# EAGLE design microwave (EAGLE 6.6.0)
AUTHOR: Yifan Hao, Joshua Adkins; REV: B; TITLE: Microwave_Radar

## Sheet 1 of 3
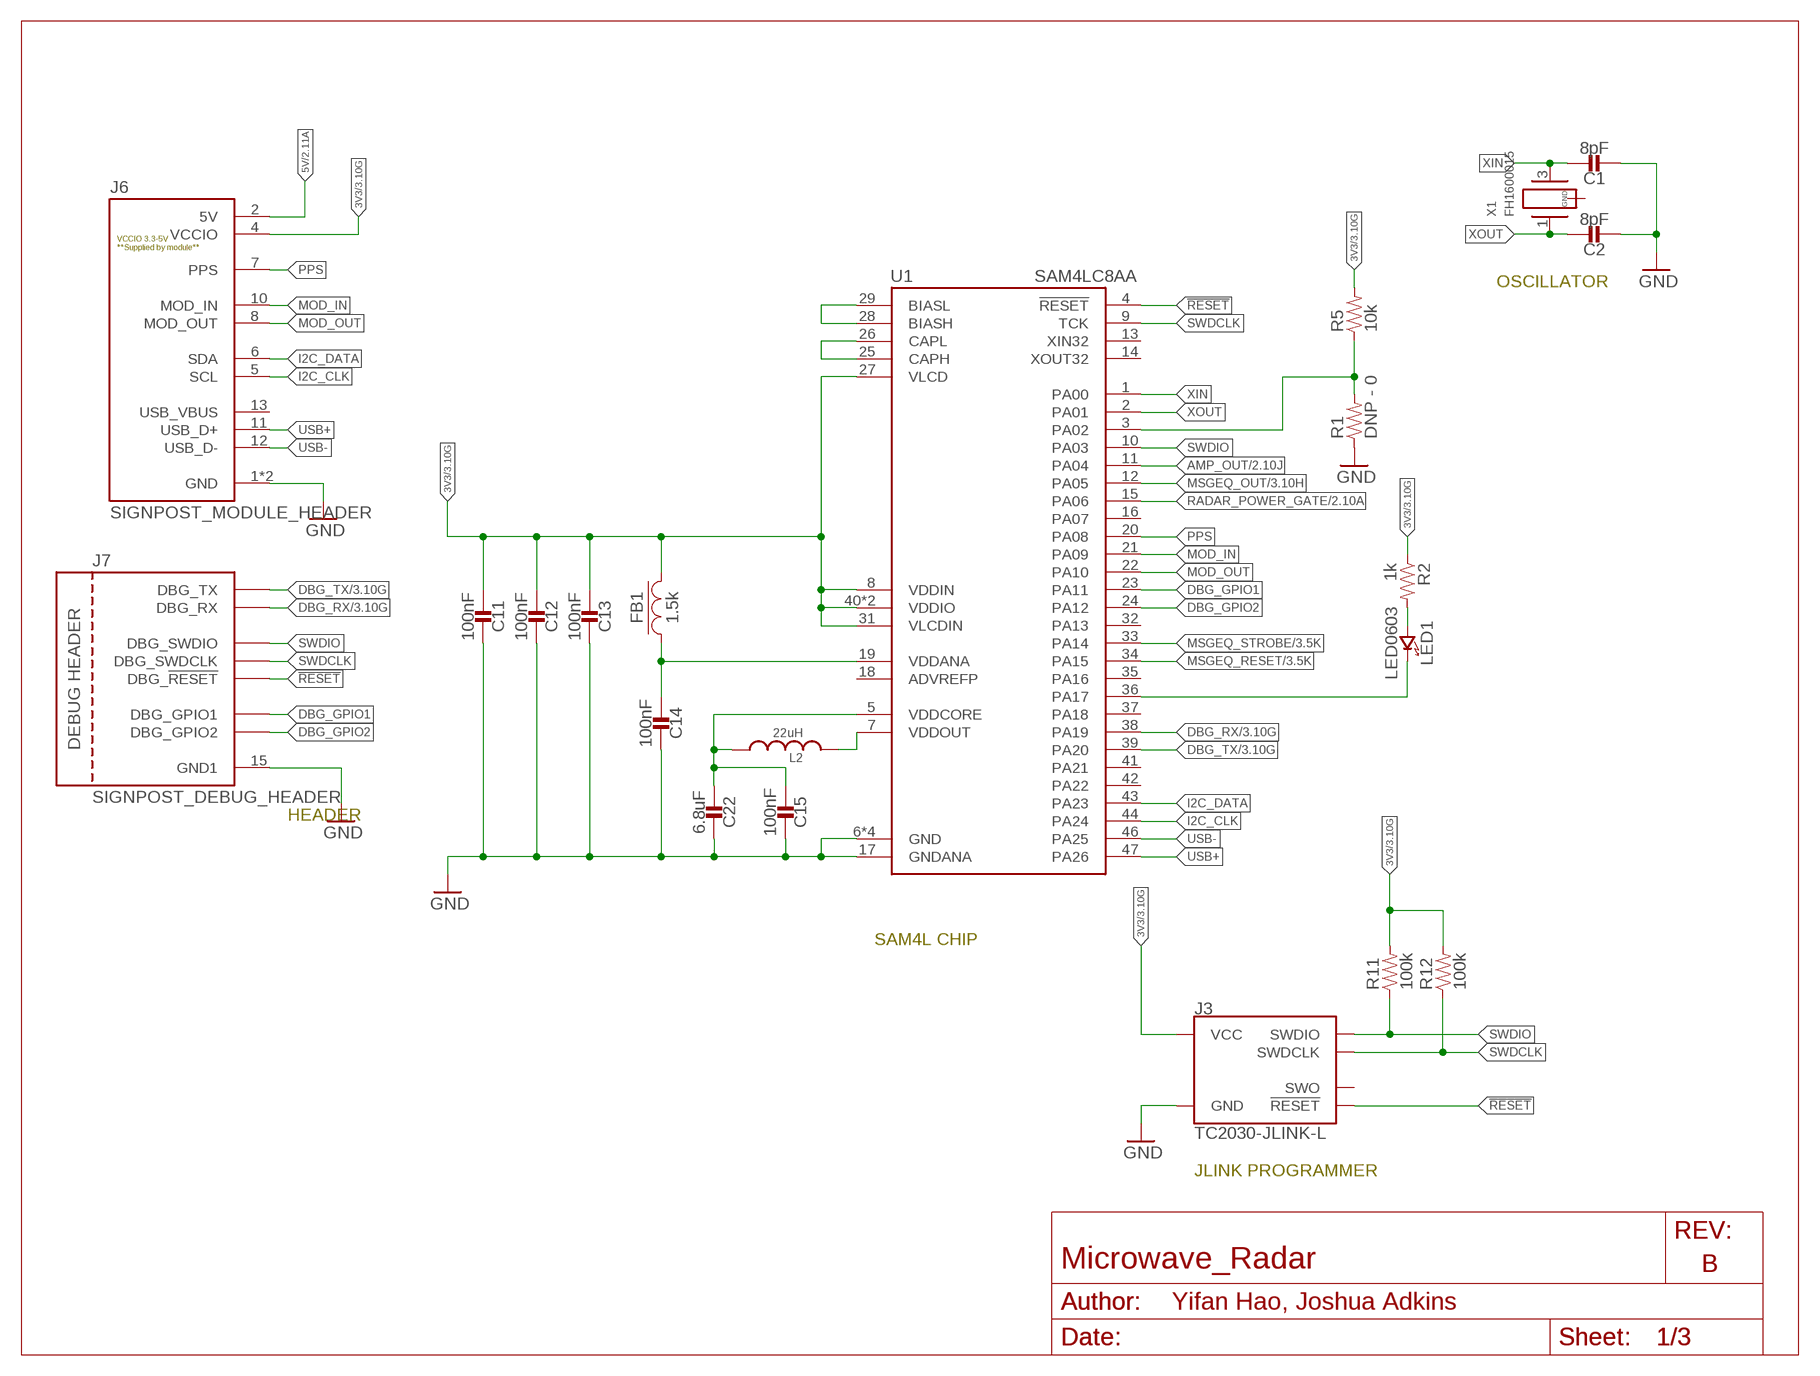
[diagram p0: schematic, sheet 1]
FRAME2 (LETTER_L_BLANK): AUTHOR: Yifan Hao; TITLE: Microwave_Radar

### Parts
C1  8pF  CAPACITOR0402_CAP  [0402_CAP]
C2  8pF  CAPACITOR0402_CAP  [0402_CAP]
C11  100nF  CAPACITOR0402_CAP  [0402_CAP]
C12  100nF  CAPACITOR0402_CAP  [0402_CAP]
C13  100nF  CAPACITOR0402_CAP  [0402_CAP]
C14  100nF  CAPACITOR0402_CAP  [0402_CAP]
C15  100nF  CAPACITOR0402_CAP  [0402_CAP]
C22  6.8uF  CAPACITOR0603_CAP  [0603_CAP]
FB1  1.5k  FERRITE_BEAD0402  [0402_CAP]
J3  TC2030-JLINK-L  [TC2030-IDC]
J6  SIGNPOST_MODULE_HEADER  [SIGNPOST_MODULE_HEADER]
J7  SIGNPOST_DEBUG_HEADER  [SIGNPOST_DEBUG_HEADER]
L2  22uH  LHQ3NP  [1212]
LED1  LED0603  [LED-0603]
R1  DNP - 0  RESISTOR0402_RES  [0402_RES]
R2  1k  RESISTOR0402_RES  [0402_RES]
R5  10k  RESISTOR0402_RES  [0402_RES]
R11  100k  RESISTOR0402_RES  [0402_RES]
R12  100k  RESISTOR0402_RES  [0402_RES]
U1  SAM4LC8AA  [QFN-48-7MM]
X1  FH1600015  [FHXXX]

### Nets
3V3: C11.2 C12.2 C13.2 FB1.2 J3.1(VCC) J6.4(VCCIO) R2.1 R5.2 R11.2 R12.2 U1.8(VDDIN) U1.27(VLCD) U1.31(VLCDIN) U1.40(VDDIO) U1.45(VDDIO) ; also sheet 3
5V: J6.2(5V) ; also sheet 2,3
!RESET: J3.3(!RESET) J7.20(DBG_!RESET) U1.4(!RESET)
AMP_OUT: U1.11(PA04) ; also sheet 2,3
DBG_GPIO1: J7.16(DBG_GPIO1) U1.23(PA11)
DBG_GPIO2: J7.19(DBG_GPIO2) U1.24(PA12)
DBG_RX: J7.18(DBG_RX) U1.38(PA19) ; also sheet 3
DBG_TX: J7.17(DBG_TX) U1.39(PA20) ; also sheet 3
GND: C1.2 C2.2 C11.1 C12.1 C13.1 C14.1 C15.1 C22.1 J3.5(GND) J6.1(GND) J6.14(GND) J7.15(GND1) R1.1 U1.6(GND) U1.17(GNDANA) U1.30(GND) U1.48(GND) U1.THERMAL(GND) ; also sheet 2,3
I2C_CLK: J6.5(SCL) U1.44(PA24)
I2C_DATA: J6.6(SDA) U1.43(PA23)
MOD_IN: J6.10(MOD_IN) U1.21(PA09)
MOD_OUT: J6.8(MOD_OUT) U1.22(PA10)
MSGEQ_OUT: U1.12(PA05) ; also sheet 3
MSGEQ_RESET: U1.34(PA15) ; also sheet 3
MSGEQ_STROBE: U1.33(PA14) ; also sheet 3
N$6: L2.P$2 U1.7(VDDOUT)
N$10: U1.28(BIASH) U1.29(BIASL)
N$11: U1.25(CAPH) U1.26(CAPL)
N$13: C14.2 FB1.1 U1.19(VDDANA)
N$14: R1.2 R5.1 U1.3(PA02)
N$34: LED1.A(ANODE) R2.2
N$35: LED1.C(CATHODE) U1.36(PA17)
N$36: C15.2 C22.2 L2.P$1 U1.5(VDDCORE)
PPS: J6.7(PPS) U1.20(PA08)
RADAR_POWER_GATE: U1.15(PA06) ; also sheet 2,3
SWDCLK: J3.4(SWDCLK) J7.21(DBG_SWDCLK) R12.1 U1.9(TCK)
SWDIO: J3.2(SWDIO) J7.22(DBG_SWDIO) R11.1 U1.10(PA03)
USB+: J6.11(USB_D+) U1.47(PA26)
USB-: J6.12(USB_D-) U1.46(PA25)
XIN: C1.1 U1.1(PA00) X1.3
XOUT: C2.1 U1.2(PA01) X1.1
Unconnected: J3.6(SWO) J6.13(USB_VBUS) U1.13(XIN32) U1.14(XOUT32) U1.16(PA07) U1.18(ADVREFP) U1.32(PA13) U1.35(PA16) U1.37(PA18) U1.41(PA21) U1.42(PA22) X1.2(GND) X1.4(GND)

### Notes on the sheet
- OSCILLATOR
- HEADER
- SAM4L CHIP
- JLINK PROGRAMMER

## Sheet 2 of 3
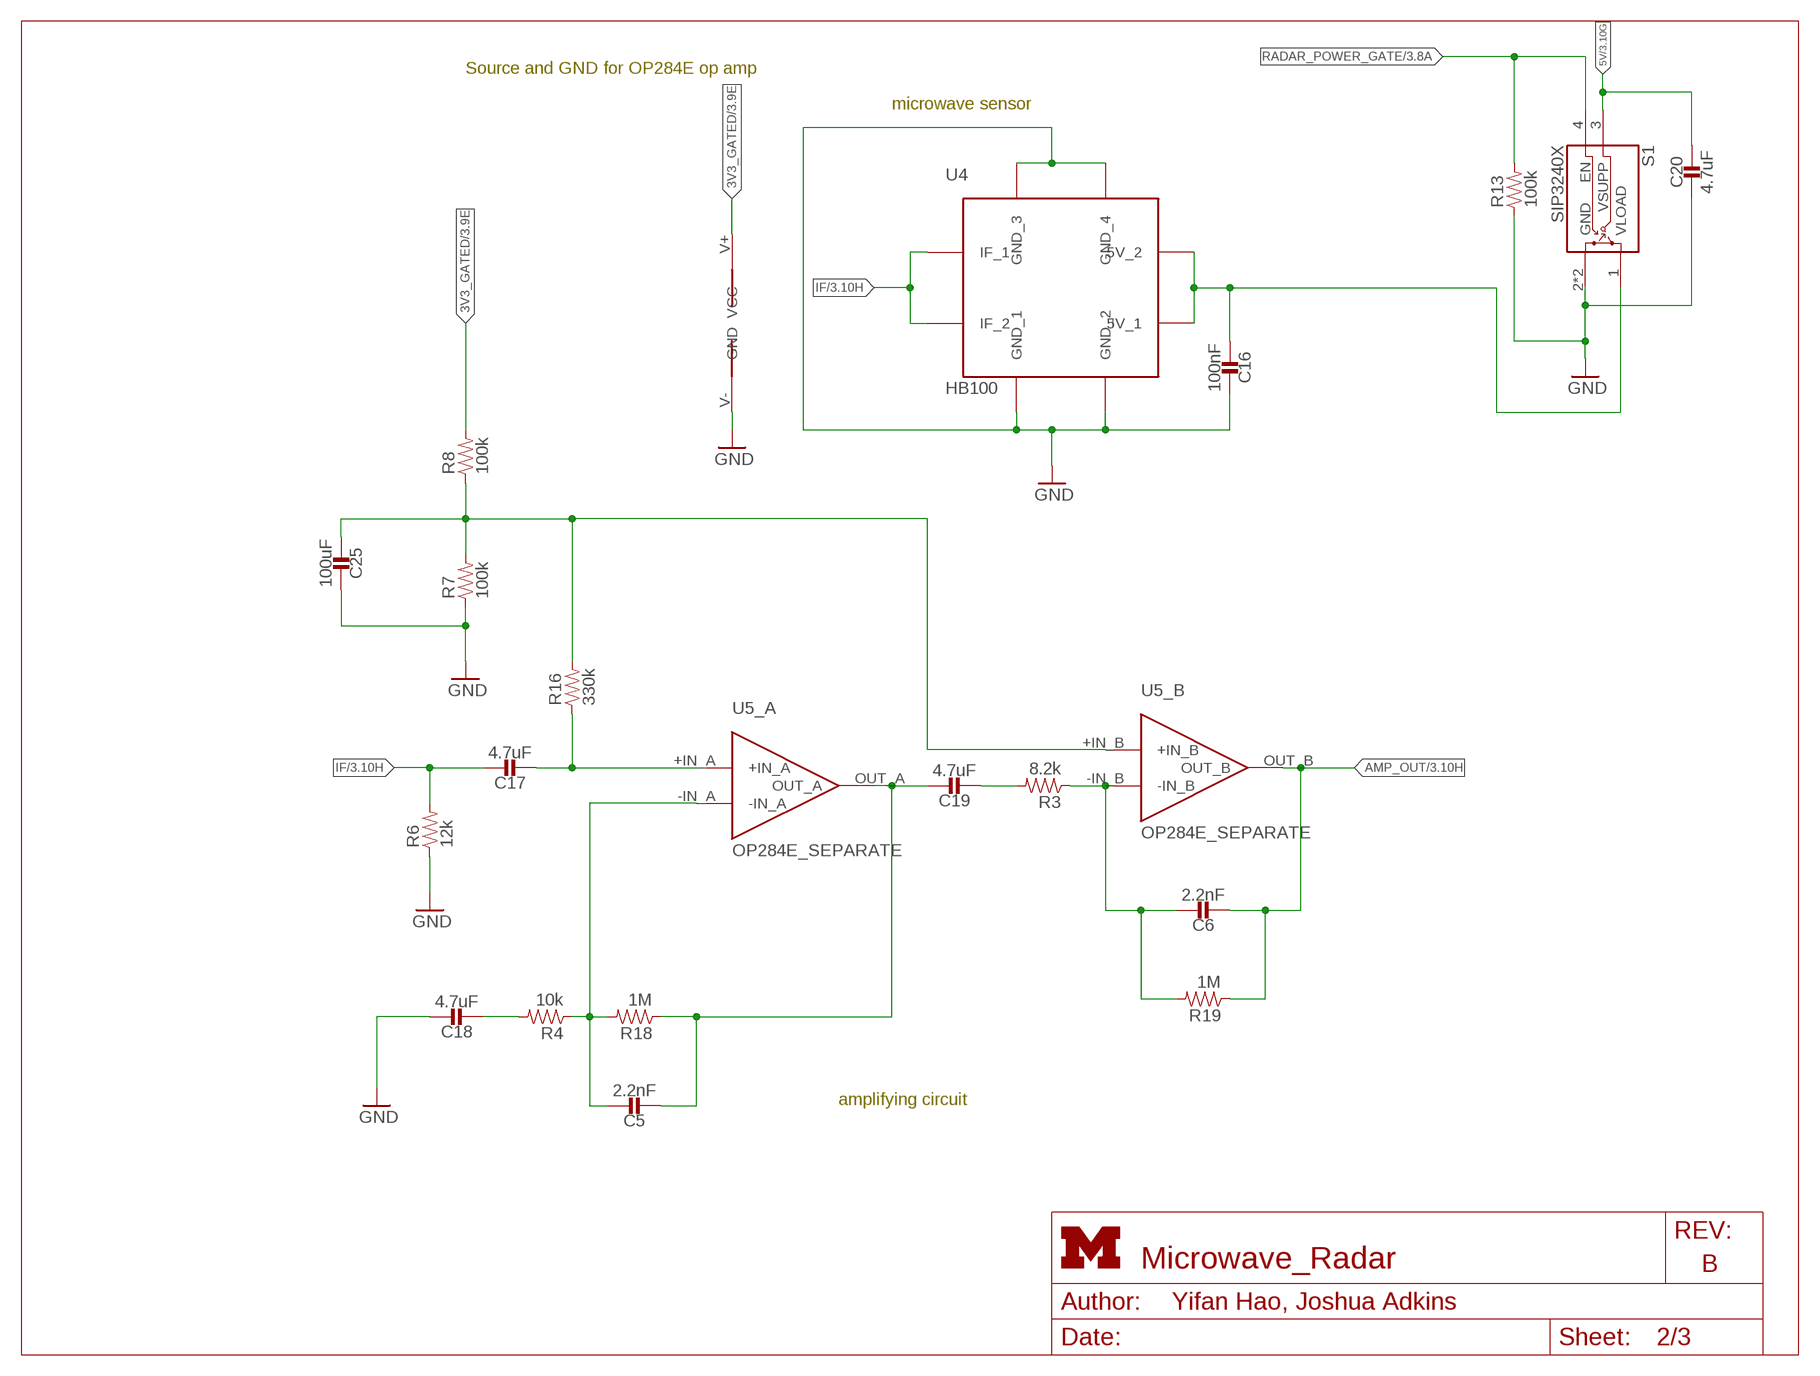
[diagram p1: schematic, sheet 2]
FRAME3 (LETTER_L_UMICH): HEIGHT: 8.5in; WIDTH: 11in

### Parts
C5  2.2nF  CAPACITOR0402_CAP  [0402_CAP]
C6  2.2nF  CAPACITOR0402_CAP  [0402_CAP]
C16  100nF  CAPACITOR0402_CAP  [0402_CAP]
C17  4.7uF  CAPACITOR0402_CAP  [0402_CAP]
C18  4.7uF  CAPACITOR0402_CAP  [0402_CAP]
C19  4.7uF  CAPACITOR0402_CAP  [0402_CAP]
C20  4.7uF  CAPACITOR0402_CAP  [0402_CAP]
C25  100uF  CAPACITOR1210_CAP  [1210_CAP]
R3  8.2k  RESISTOR0402_RES  [0402_RES]
R4  10k  RESISTOR0402_RES  [0402_RES]
R6  12k  RESISTOR0402_RES  [0402_RES]
R7  100k  RESISTOR0402_RES  [0402_RES]
R8  100k  RESISTOR0402_RES  [0402_RES]
R13  100k  RESISTOR0402_RES  [0402_RES]
R16  330k  RESISTOR0402_RES  [0402_RES]
R18  1M  RESISTOR0402_RES  [0402_RES]
R19  1M  RESISTOR0402_RES  [0402_RES]
S1  SIP3240X  [TDFN4]
U4  HB100  [HB100]
U5  OP284E_SEPARATE  [OP284E_SEPARATE]

### Nets
3V3_GATED: R8.2 U5.V+(VCC) ; also sheet 3
5V: C20.1 S1.3(VSUPP) ; also sheet 1,3
5V_GATED: C16.2 S1.1(VLOAD) U4.5V_1 U4.5V_2
AMP_OUT: C6.2 R19.1 U5.OUT_B(_B:OUT_B) ; also sheet 1,3
GND: C16.1 C18.1 C20.2 C25.1 R6.1 R7.1 R13.1 S1.2(GND) S1.PAD(GND) U4.GND_1 U4.GND_2 U4.GND_3 U4.GND_4 U5.V-(GND) ; also sheet 1,3
IF: C17.1 R6.2 U4.IF_1 U4.IF_2 ; also sheet 3
N$1: C25.2 R7.2 R8.1 R16.2 U5.+IN_B(_B:+IN_B)
N$9: C17.2 R16.1 U5.+IN_A(_A:+IN_A)
N$12: C5.1 R4.1 R18.2 U5.-IN_A(_A:-IN_A)
N$15: C18.2 R4.2
N$17: C5.2 C19.1 R18.1 U5.OUT_A(_A:OUT_A)
N$18: C19.2 R3.2
N$19: C6.1 R3.1 R19.2 U5.-IN_B(_B:-IN_B)
RADAR_POWER_GATE: R13.2 S1.4(EN) ; also sheet 1,3

### Notes on the sheet
- Source and GND for OP284E op amp
- microwave sensor
- amplifying circuit

## Sheet 3 of 3
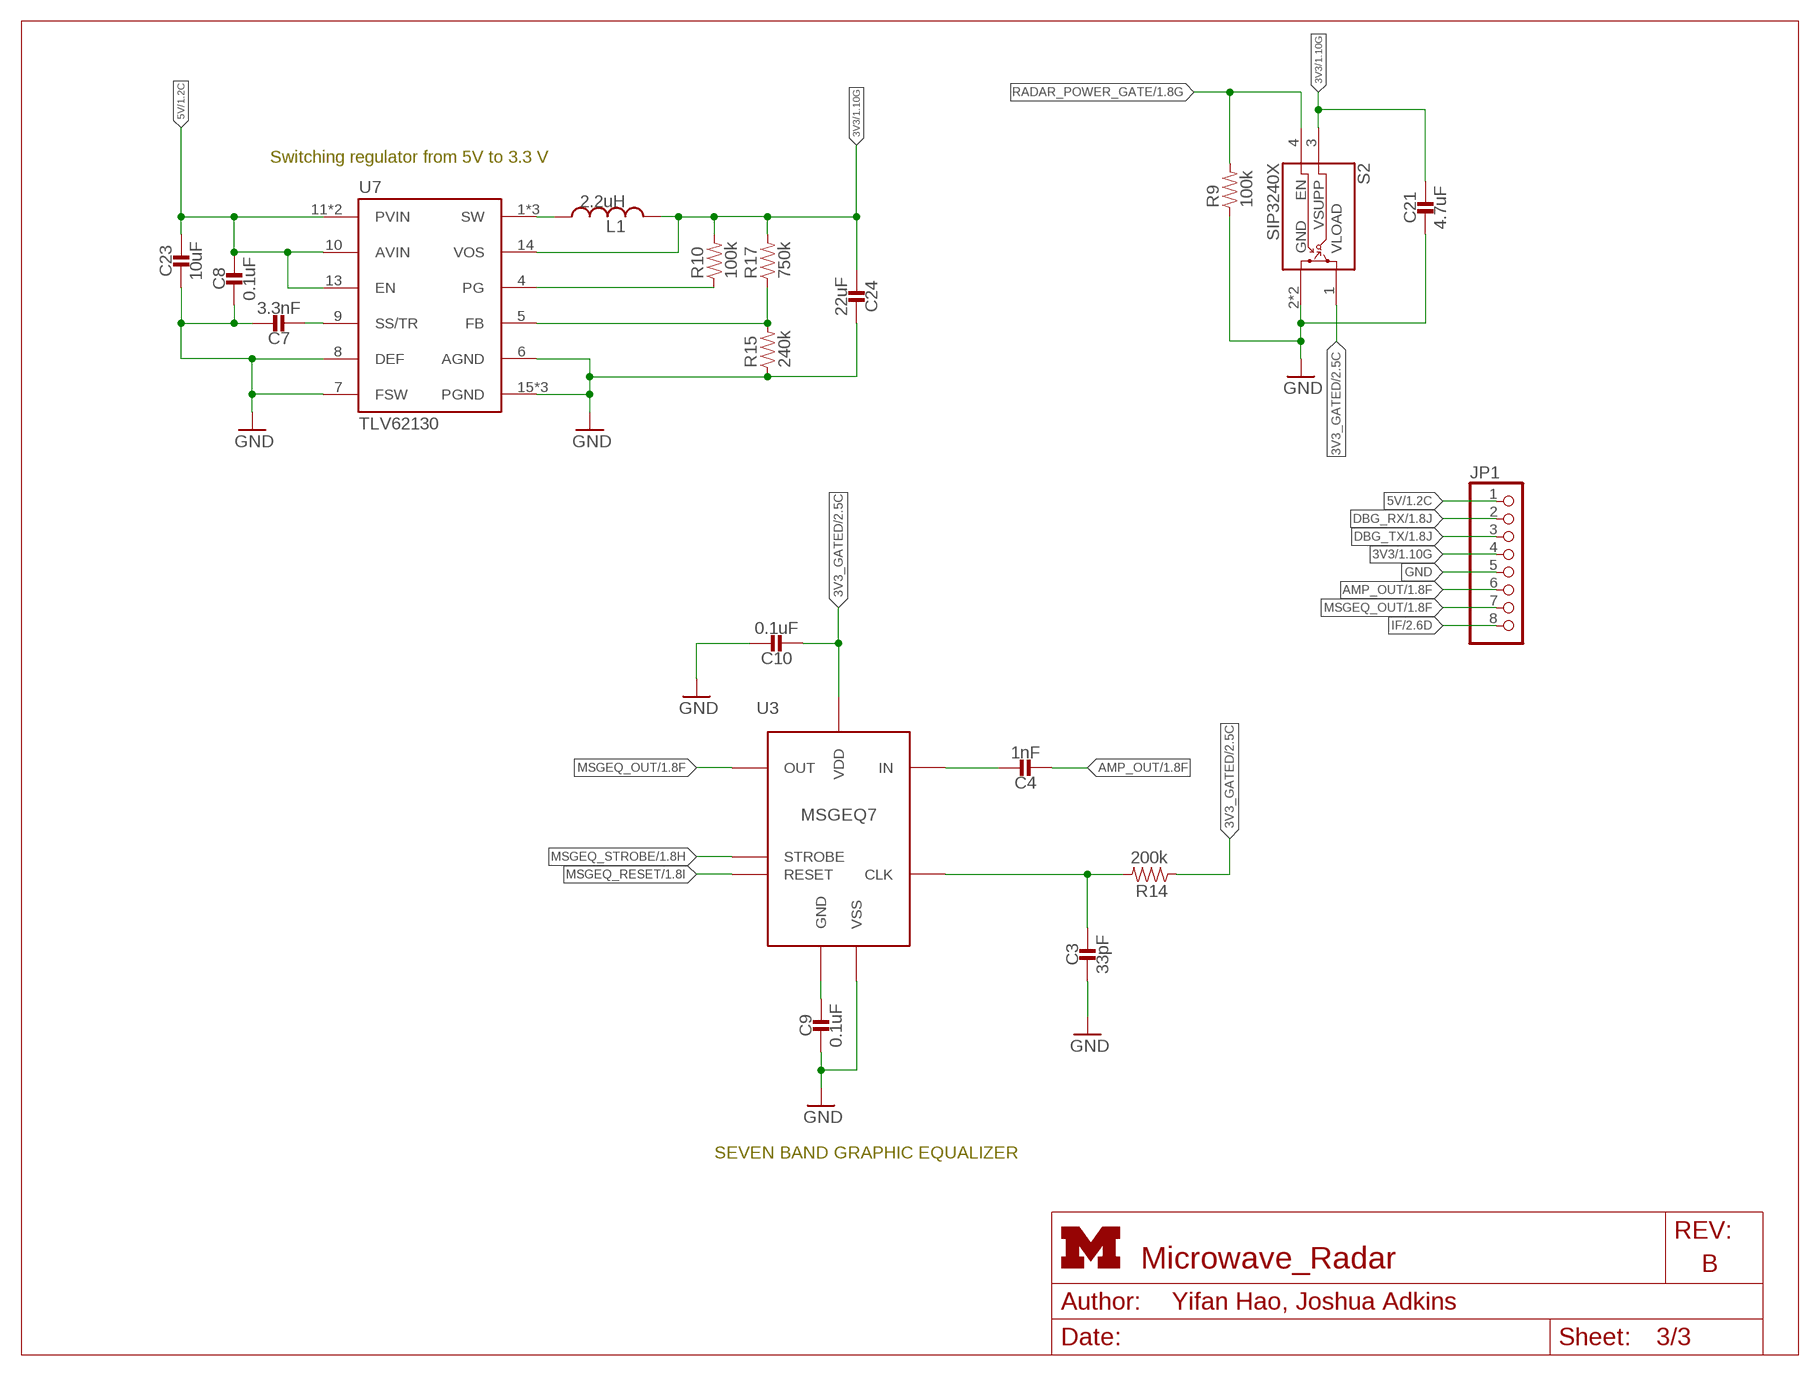
[diagram p2: schematic, sheet 3]
FRAME4 (LETTER_L_UMICH): HEIGHT: 8.5in; WIDTH: 11in

### Parts
C3  33pF  CAPACITOR0603_CAP  [0603_CAP]
C4  1nF  CAPACITOR0603_CAP  [0603_CAP]
C7  3.3nF  CAPACITOR0402_CAP  [0402_CAP]
C8  0.1uF  CAPACITOR0402_CAP  [0402_CAP]
C9  0.1uF  CAPACITOR0603_CAP  [0603_CAP]
C10  0.1uF  CAPACITOR0603_CAP  [0603_CAP]
C21  4.7uF  CAPACITOR0402_CAP  [0402_CAP]
C23  10uF  CAPACITOR0805_CAP  [0805_CAP]
C24  22uF  CAPACITOR0603_CAP  [0603_CAP]
JP1  PINHD-1X8  [1X08]
L1  2.2uH  INDUCTORIHL  [IHL-1212BZ-11]
R9  100k  RESISTOR0402_RES  [0402_RES]
R10  100k  RESISTOR0402_RES  [0402_RES]
R14  200k  RESISTOR0603_RES  [0603-RES]
R15  240k  RESISTOR0402_RES  [0402_RES]
R17  750k  RESISTOR0402_RES  [0402_RES]
S2  SIP3240X  [TDFN4]
U3  MSGEQ7  [DIP-8]
U7  TLV62130  [TQFN-16/3MM]

### Nets
3V3: C21.1 C24.2 JP1.4 L1.P$2 R10.2 R17.2 S2.3(VSUPP) U7.14(VOS) ; also sheet 1
3V3_GATED: C10.2 R14.1 S2.1(VLOAD) U3.1(VDD) ; also sheet 2
5V: C8.1 C23.P$1 JP1.1 U7.10(AVIN) U7.11(PVIN) U7.12(PVIN) U7.13(EN) ; also sheet 1,2
AMP_OUT: C4.2 JP1.6 ; also sheet 1,2
DBG_RX: JP1.2 ; also sheet 1
DBG_TX: JP1.3 ; also sheet 1
GND: C3.2 C7.1 C8.2 C9.2 C10.1 C21.2 C23.P$2 C24.1 JP1.5 R9.1 R15.1 S2.2(GND) S2.PAD(GND) U3.2(VSS) U7.6(AGND) U7.7(FSW) U7.8(DEF) U7.15(PGND) U7.16(PGND) U7.GND ; also sheet 1,2
IF: JP1.8 ; also sheet 2
MSGEQ_OUT: JP1.7 U3.3(OUT) ; also sheet 1
MSGEQ_RESET: U3.7(RESET) ; also sheet 1
MSGEQ_STROBE: U3.4(STROBE) ; also sheet 1
N$2: C3.1 R14.2 U3.8(CLK)
N$3: C4.1 U3.5(IN)
N$7: C9.1 U3.6(GND)
N$42: C7.2 U7.9(SS/TR)
N$43: L1.P$1 U7.1(SW) U7.2(SW) U7.3(SW)
N$44: R10.1 U7.4(PG)
N$45: R15.2 R17.1 U7.5(FB)
RADAR_POWER_GATE: R9.2 S2.4(EN) ; also sheet 1,2

### Notes on the sheet
- Switching regulator from 5V to 3.3 V
- SEVEN BAND GRAPHIC EQUALIZER

## Library data of the parts
C1 C2 = passives:CAPACITOR: SMD Capacitor; DESCRIPTION: CAP CER 8PF 50V C0G/NP0 0402; DIGIKEY: 490-8230-1-ND; MANUFACTURER: Murata; MPN: GRM1555C1H8R0BA01D
C3 = passives:CAPACITOR: SMD Capacitor; DESCRIPTION: CAP CER 33PF 50V C0G/NP0 0603; DIGIKEY: 490-1415-1-ND; MANUFACTURER: Murata; MPN: GRM1885C1H330JA01D
C4 = passives:CAPACITOR: SMD Capacitor; DESCRIPTION: CAP CER 1000PF 50V X7R 0603; DIGIKEY: 490-1494-1-ND; MANUFACTURER: Murata; MPN: GRM188R71H102KA01D
C5 C6 = passives:CAPACITOR: SMD Capacitor; DESCRIPTION: CAP CER 2200PF 6.3V 10% X7R 0402; DIGIKEY: 490-11418-1-ND; MANUFACTURER: Murata; MPN: GRM155R70J222KA01D
C7 = passives:CAPACITOR: SMD Capacitor; DESCRIPTION: CAP CER 3300PF 50V 10% X7R 0402; DIGIKEY: 490-3248-1-ND; MANUFACTURER: Murata; MPN: GRM155R71H332KA01D
C8 = passives:CAPACITOR: SMD Capacitor; DESCRIPTION: CAP CER 0.1UF 16V X7R 0402; DIGIKEY: 490-6328-1-ND; MANUFACTURER: Murata; MPN: GRM155R71C104KA88J
C9 C10 = passives:CAPACITOR: SMD Capacitor; DESCRIPTION: CAP CER 0.1UF 16V X7R 0603; DIGIKEY: 490-1532-1-ND; MANUFACTURER: Murata; MPN: GRM188R71C104KA01D
C11-C16 = passives:CAPACITOR: SMD Capacitor; DESCRIPTION: CAP CER 0.1UF 10V X7R 0402; DIGIKEY: 490-10777-1-ND; MANUFACTURER: Murata; MPN: GRM155R71A104JA01D
C17-C21 = passives:CAPACITOR: SMD Capacitor; DESCRIPTION: CAP CER 4.7UF 6.3V X5R 0402; DIGIKEY: 1276-1481-1-ND; MANUFACTURER: Samsung; MPN: CL05A475KQ5NRNC
C22 = passives:CAPACITOR: SMD Capacitor; DESCRIPTION: CAP CER 6.8UF 10V X5R 0603; DIGIKEY: 445-7484-1-ND; MANUFACTURER: TDK; MPN: C1608X5R1A685K080AC
C23 = passives:CAPACITOR: SMD Capacitor; DESCRIPTION: CAP CER 10UF 10V X5R 0805; DIGIKEY: 399-4925-1-ND; MANUFACTURER: KEMET; MPN: C0805C106K8PACTU
C24 = passives:CAPACITOR: SMD Capacitor; DESCRIPTION: CAP CER 22UF 6.3V X5R 0603; DIGIKEY: 311-1815-1-ND; MANUFACTURER: Yageo; MPN: CC0603MRX5R5BB226
C25 = passives:CAPACITOR: SMD Capacitor; DESCRIPTION: CAP CER 100UF 6.3V 20% X5R 1210; DIGIKEY: 490-3390-1-ND; MANUFACTURER: Murata; MPN: GRM32ER60J107ME20L
FB1 = passives:FERRITE_BEAD; DESCRIPTION: FERRITE BEAD 1.5 KOHM 0603 1LN; DIGIKEY: 490-5216-1-ND; MANUFACTURER: Murata; MPN: BLM18HE152SN1D
J3 = connector:TC2030-JLINK
J6 = signpost:SIGNPOST_MODULE_HEADER: The 14 pin signpost module header; DIGIKEY: S9170-ND; MANUFACTURER: Sullins Connector; MPN: SBH11-PBPC-D07-ST-BK
J7 = signpost:SIGNPOST_DEBUG_HEADER: The 8 Pin signpost Debug Header; DIGIKEY: S2221EC-04-ND; MANUFACTURER: Sullins Connector; MPN: PRPC004DFBN-RC
JP1 = pinhead:PINHD-1X8: PIN HEADER
L1 = passives:INDUCTOR: A very specific inductor; DIGIKEY: 541-1322-1-ND; MANUFACTURER: Vishay Dale; MPN: IHLP1212BZER2R2M11
L2 = signpost:LHQ3NP: LHQ3NP Inductor; DIGIKEY: 490-5350-1-ND; MANUFACTURER: Murata; MPN: LQH3NPN220MJ0L
LED1 = leds:LED: LED; DESCRIPTION: LED GREEN CLEAR 0603 SMD; DIGIKEY: 160-1446-1-ND; MANUFACTURER: Lite-On; MPN: LTST-C191KGKT
R1 = passives:RESISTOR: Resistor Basic schematic elements and footprints for 0603, 1206, and PTH resistors.; DIGIKEY: 311-0.0JRCT-ND; MANUFACTURER: Yageo; MPN: RC0402JR-070RL
R2 = passives:RESISTOR: Resistor Basic schematic elements and footprints for 0603, 1206, and PTH resistors.; DESCRIPTION: RES SMD 1K OHM 1% 1/16W 0402; DIGIKEY: 1276-3430-1-ND; MANUFACTURER: Samsung; MPN: RC1005F102CS
R3 = passives:RESISTOR: Resistor Basic schematic elements and footprints for 0603, 1206, and PTH resistors.; DESCRIPTION: RES SMD 8.2K OHM 1% 1/16W 0402; DIGIKEY: 311-8.20KLRCT-ND; MANUFACTURER: Yageo; MPN: RC0402FR-078K2L
R4 R5 = passives:RESISTOR: Resistor Basic schematic elements and footprints for 0603, 1206, and PTH resistors.; DESCRIPTION: RES SMD 10K OHM 1% 1/16W 0402; DIGIKEY: 1276-3431-1-ND; MANUFACTURER: Samsung; MPN: RC1005F103CS
R6 = passives:RESISTOR: Resistor Basic schematic elements and footprints for 0603, 1206, and PTH resistors.; DESCRIPTION: RES SMD 12K OHM 1% 1/16W 0402; DIGIKEY: 1276-4122-1-ND; MANUFACTURER: Samsung; MPN: RC1005F123CS
R7-R13 R18 R19 = passives:RESISTOR: Resistor Basic schematic elements and footprints for 0603, 1206, and PTH resistors.; DESCRIPTION: RES SMD 100K OHM 1% 1/16W 0402; DIGIKEY: 1276-3432-1-ND; MANUFACTURER: Samsung; MPN: RC1005F104CS
R14 = passives:RESISTOR: Resistor Basic schematic elements and footprints for 0603, 1206, and PTH resistors.; DESCRIPTION: RES SMD 200K OHM 5% 1/10W 0603; DIGIKEY: 311-200KGRCT-ND; MANUFACTURER: Yageo; MPN: RC0603JR-07200KL
R15 = passives:RESISTOR: Resistor Basic schematic elements and footprints for 0603, 1206, and PTH resistors.; DESCRIPTION: RES SMD 240K OHM 1% 1/10W 0402; DIGIKEY: P240KLCT-ND; MANUFACTURER: Panasonic; MPN: ERJ-2RKF2403X
R16 = passives:RESISTOR: Resistor Basic schematic elements and footprints for 0603, 1206, and PTH resistors.; DESCRIPTION: RES SMD 330K OHM 1% 1/16W 0402; DIGIKEY: 1276-4244-1-ND; MANUFACTURER: Samsung; MPN: RC1005F334CS
R17 = passives:RESISTOR: Resistor Basic schematic elements and footprints for 0603, 1206, and PTH resistors.; DESCRIPTION: RES SMD 750K OHM 1% 1/10W 0402; DIGIKEY: P750KLCT-ND; MANUFACTURER: Panasonic; MPN: ERJ-2RKF7503X
S1 S2 = signpost:SIP3240X: High power (2.4 A) high-side switch; DIGIKEY: SIP32402ADNP-T1GE4CT-ND; MANUFACTURER: Vishay; MPN: SIP32402ADNP-T1GE4
U1 = chips:SAM4LC8AA: Atmel SAM4L microcontroller. ARM Cortex M4 with 512 KB Flash and 64 KB RAM; DIGIKEY: ATSAM4LC8AA-MU-ND; MANUFACTURER: Microchip Technology; MPN: ATSAM4LC8AA-MU
U3 = chips:MSGEQ7: A CMOS spectrum analyzer; DIGIKEY: 1568-1335-ND; MANUFACTURER: Sparkfun Electronics; MPN: COM-10468
U4 = microwave_radar:HB100; DESCRIPTION: CONN HEADER 2POS .100" SNGL TIN; DIGIKEY: SAM1067-02-ND; MANUFACTURER: Samtec; MPN: TSW-102-17-T-S
U5 = microwave_radar:OP284E_SEPARATE; DESCRIPTION: IC OPAMP GP 4.25MHZ RRO 8SOIC; DIGIKEY: OP284ESZ-ND; MANUFACTURER: Analog Devices; MPN: OP284ESZ
U7 = chips:TLV62130: High Efficient 3A switching step-down regulator. 1V-5V out, 4V-17V in.; DIGIKEY: 296-35978-1-ND; MANUFACTURER: Texas Instruments; MPN: TLV62130RGTR
X1 = crystals:FH1600015: Pericom Type FH 16 MHz 2.5 x 2.0 mm; DIGIKEY: FH1600015CT-ND; MANUFACTURER: Diodes Incorporated; MPN: FH1600015

## Board
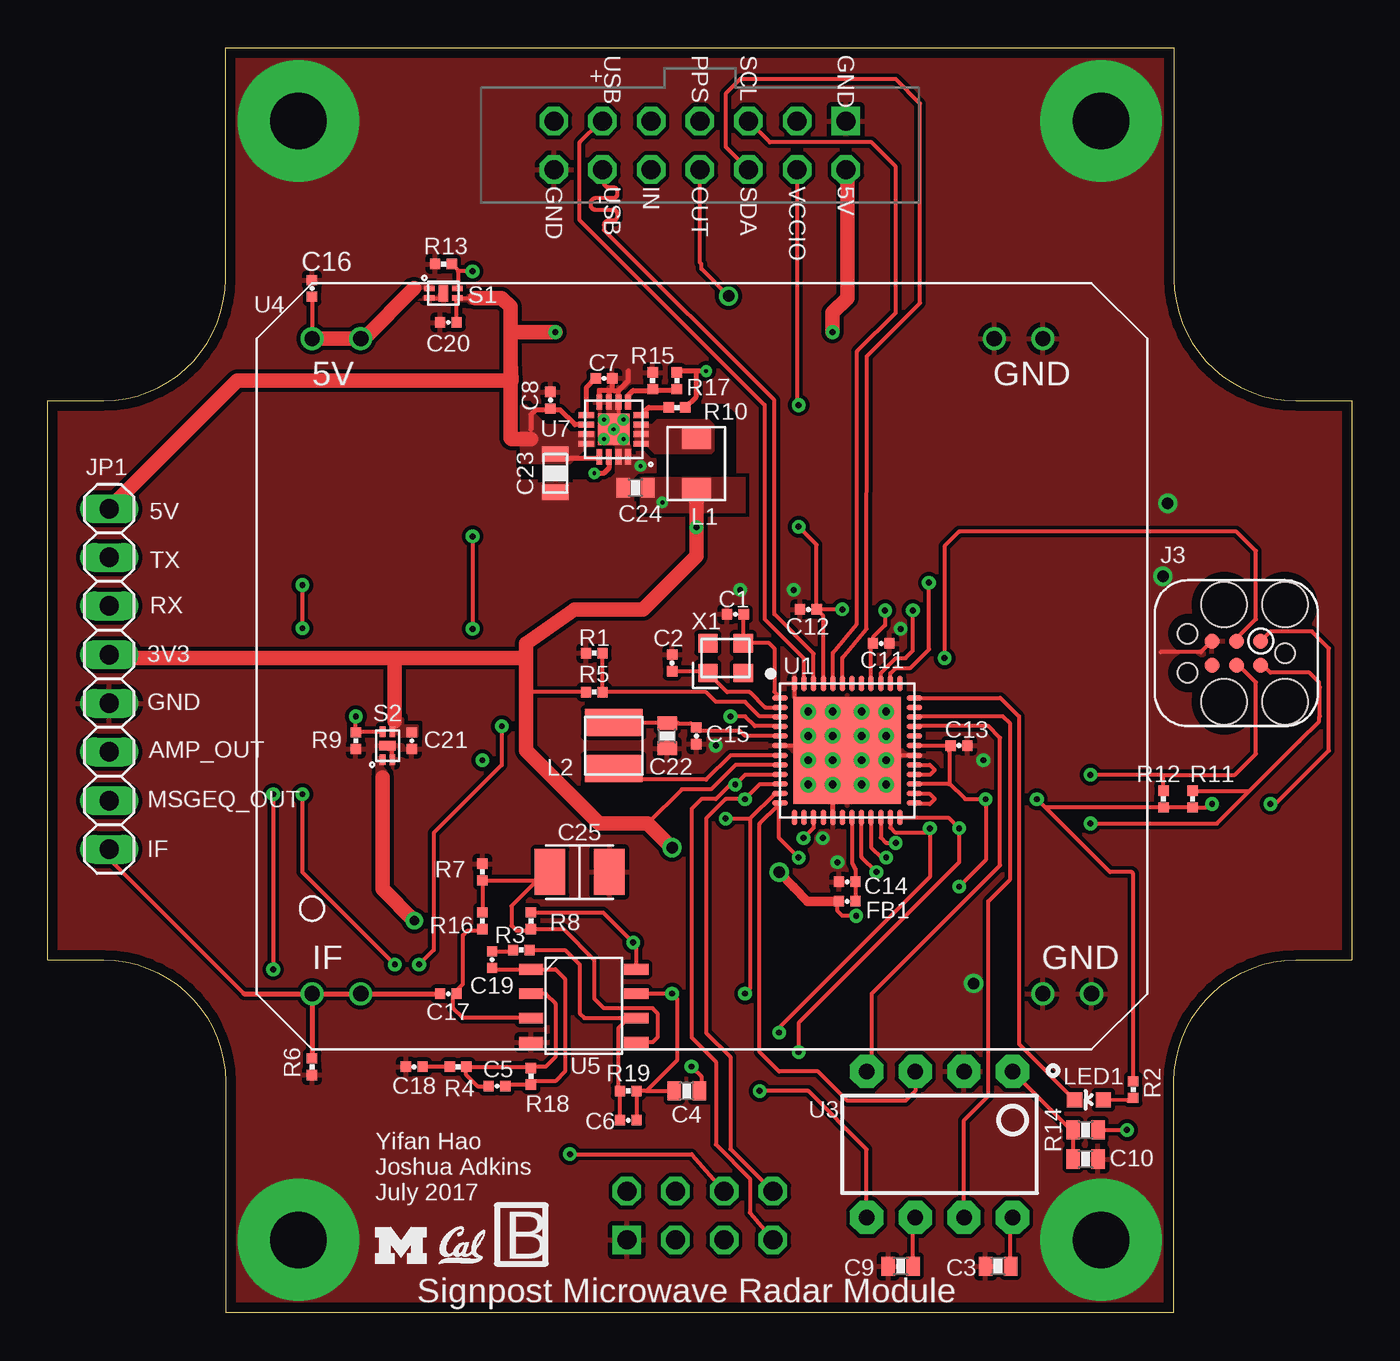
[diagram p3: board, top side]
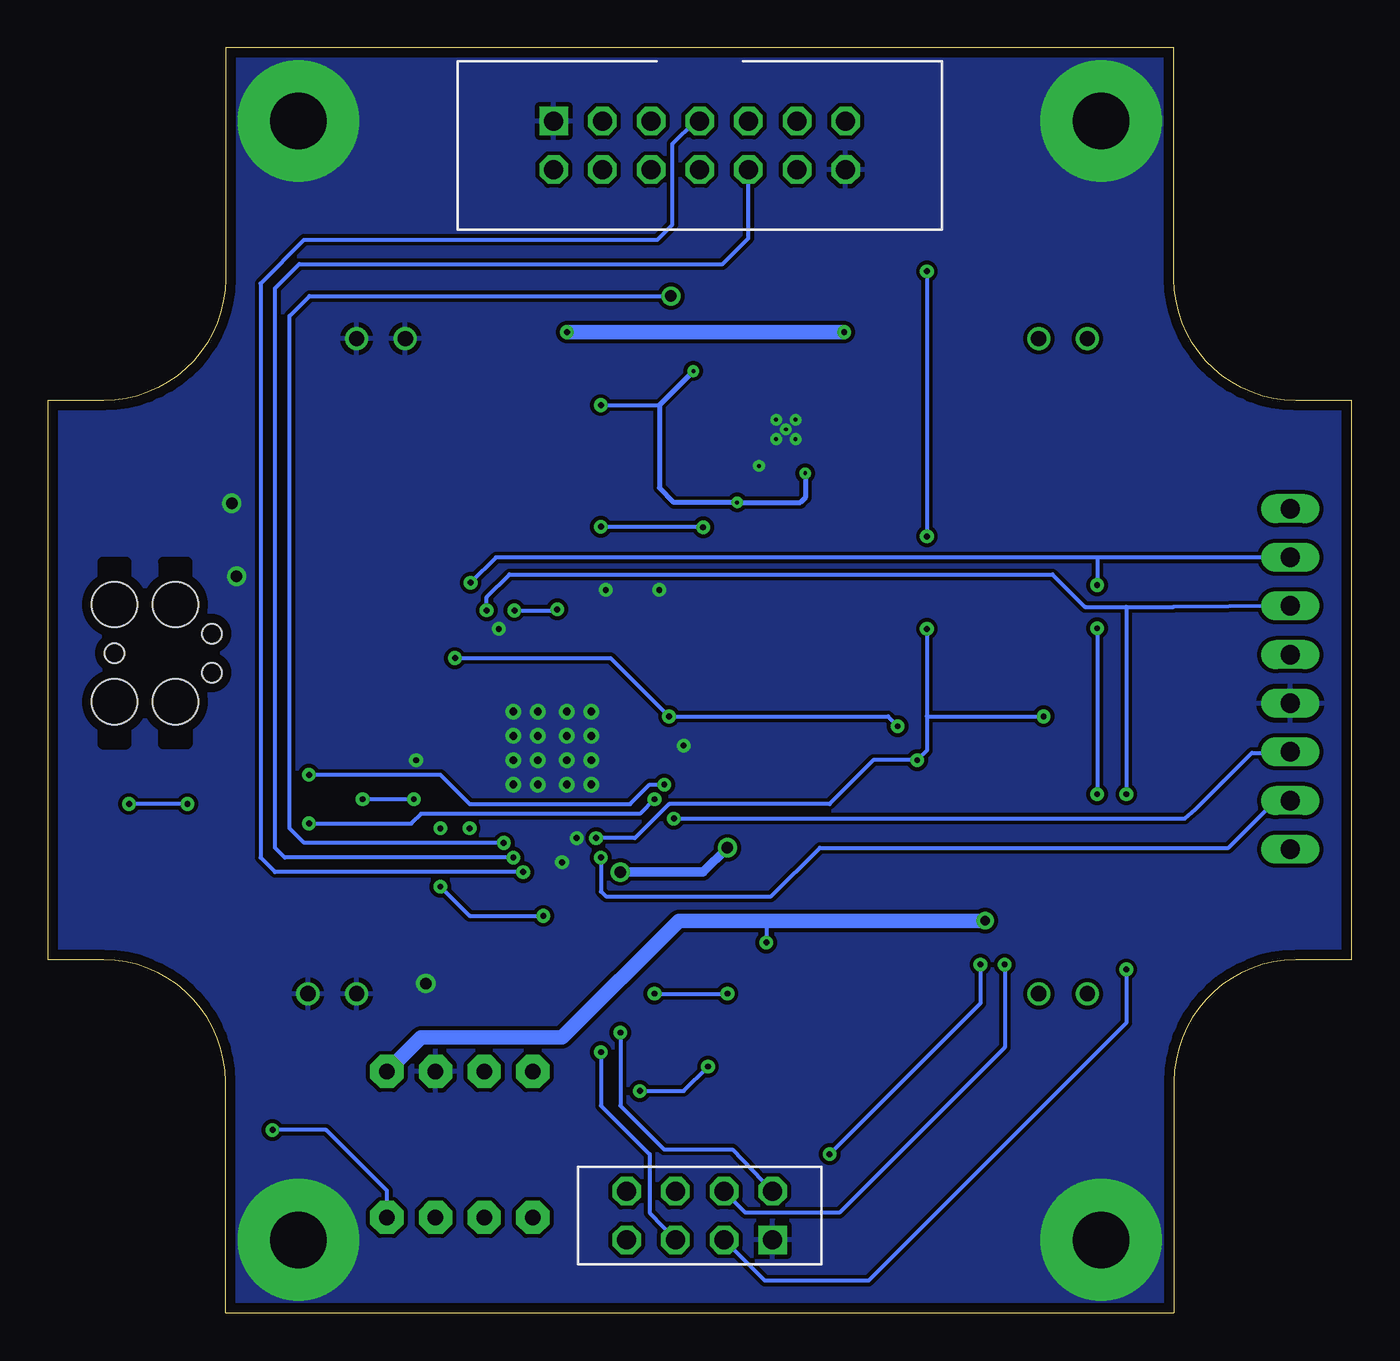
[diagram p4: board, bottom side, seen from below]

Size 68.07 x 66.04 mm. Coordinates in mm from the lower left corner, seen from the top.
Outline: 9.27,66.04 58.8,66.04 58.8,53.97 arc90 65.15,47.62 68.07,47.62 68.07,18.41 65.15,18.41 arc90 58.8,12.06 58.8,0 9.27,0 9.27,12.06 arc90 2.92,18.41 0,18.41 0,47.62 2.92,47.62 arc90 9.27,53.97 9.27,66.04
Copper layers (1*16): Top 0.0178mm / dielectric 59mil / Bottom 0.0178mm
Design rules "quickturn_co_kr_1oz": minimum track width 4mil, minimum drill 0.200659375mm, track to track 4mil, track to pad 4mil, pad to pad 4mil, via to via 4mil, smd to smd 4mil, copper to edge 20mil, drill to drill 16mil, minimum pad ring 8mil, minimum via ring 8mil, stop-mask expansion 3mil, vias tented up to drill 50mil, thermal gap 10mil

### Footprints (pad centres in the part's own frame; a part is rotated, then mirrored left to right if it is on the bottom)
0402_CAP = smd 0.536 x 0.546: 1 -0.433,0; 2 0.433,0
0603_CAP = smd 0.7 x 1: 1 -0.65,0; 2 0.65,0
0805_CAP = smd 0.8 x 1.4: P$1 1,0; P$2 -1,0
1210_CAP = smd 2.4 x 1.6: 1 0,1.55; 2 0,-1.55
TC2030-IDC = smd 0.787 x 0.787: 1 -1.27,-0.635; 2 -1.27,0.635; 3 0,-0.635; 4 0,0.635; 5 1.27,-0.635; 6 1.27,0.635 | hole 2.375: -2.54,2.54; 0.635,2.54; 0.635,-2.54; -2.54,-2.54 | hole 1.016: -2.54,0; 2.54,1.016; 2.54,-1.016
SIGNPOST_MODULE_HEADER = drill 0.991 square: 1 7.62,1.27 | drill 0.991 octagon: 2 7.62,-1.27; 3 5.08,1.27; 4 5.08,-1.27; 5 2.54,1.27; 6 2.54,-1.27; 7 0,1.27; 8 0,-1.27; 9 -2.54,1.27; 10 -2.54,-1.27; 11 -5.08,1.27; 12 -5.08,-1.27; 13 -7.62,1.27; 14 -7.62,-1.27
SIGNPOST_DEBUG_HEADER = drill 0.991 square: 15 -3.81,-1.27 | drill 0.991 octagon: 16 -3.81,1.27; 17 -1.27,-1.27; 18 -1.27,1.27; 19 1.27,-1.27; 20 1.27,1.27; 21 3.81,-1.27; 22 3.81,1.27
1X08 = drill 1.016 long: 1 -8.89,0; 2 -6.35,0; 3 -3.81,0; 4 -1.27,0; 5 1.27,0; 6 3.81,0; 7 6.35,0; 8 8.89,0
IHL-1212BZ-11 = smd 1.2 x 1.5: P$1 -1.35,0; P$2 1.35,0
1212 = smd 1.4 x 3: P$1 -1.2,0; P$2 1.2,0
LED-0603 = smd 0.8 x 0.8: A 0,-0.75; C 0,0.75
0402_RES = smd 0.536 x 0.546: 1 -0.433,0; 2 0.433,0
0603-RES = smd 0.7 x 1: 1 -0.65,0; 2 0.65,0
TDFN4 = smd 0.3 x 0.55: 1 -0.25,-0.725; 2 0.25,-0.725; 3 0.25,0.725; 4 -0.25,0.725 | smd 0.86 x 0.5: PAD 0,0
QFN-48-7MM = smd 0.8 x 0.28: 1 -3.5,2.75; 2 -3.5,2.25; 3 -3.5,1.75; 4 -3.5,1.25; 5 -3.5,0.75; 6 -3.5,0.25; 7 -3.5,-0.25; 8 -3.5,-0.75; 9 -3.5,-1.25; 10 -3.5,-1.75; 11 -3.5,-2.25; 12 -3.5,-2.75; 25 3.5,-2.75; 26 3.5,-2.25; 27 3.5,-1.75; 28 3.5,-1.25; 29 3.5,-0.75; 30 3.5,-0.25; 31 3.5,0.25; 32 3.5,0.75; 33 3.5,1.25; 34 3.5,1.75; 35 3.5,2.25; 36 3.5,2.75 | smd 0.28 x 0.8: 13 -2.75,-3.5; 14 -2.25,-3.5; 15 -1.75,-3.5; 16 -1.25,-3.5; 17 -0.75,-3.5; 18 -0.25,-3.5; 19 0.25,-3.5; 20 0.75,-3.5; 21 1.25,-3.5; 22 1.75,-3.5; 23 2.25,-3.5; 24 2.75,-3.5; 37 2.75,3.5; 38 2.25,3.5; 39 1.75,3.5; 40 1.25,3.5; 41 0.75,3.5; 42 0.25,3.5; 43 -0.25,3.5; 44 -0.75,3.5; 45 -1.25,3.5; 46 -1.75,3.5; 47 -2.25,3.5; 48 -2.75,3.5 | smd 5.6 x 5.6: THERMAL 0,0
DIP-8 = drill 0.813 pad 1.727 octagon: 1 -3.81,-3.81; 2 -1.27,-3.81; 3 1.27,-3.81; 4 3.81,-3.81; 5 3.81,3.81; 6 1.27,3.81; 7 -1.27,3.81; 8 -3.81,3.81
HB100 = drill 0.8: 5V_1 0,34.2; 5V_2 2.54,34.2; GND_1 35.62,34.2; GND_2 38.16,34.2; GND_3 38.16,0; GND_4 40.7,0; IF_1 0,0; IF_2 2.54,0
OP284E_SEPARATE = smd 1.27 x 0.55: +IN_A 0,2.54; +IN_B 5.5,1.27; -IN_A 0,3.81; -IN_B 5.5,2.54; OUT_A 0,5.08; OUT_B 5.5,3.81; V+ 5.5,5.08; V- 0,1.27
TQFN-16/3MM = smd 0.3 x 0.8: 1 -0.75,-1.43; 2 -0.25,-1.43; 3 0.25,-1.43; 4 0.75,-1.43; 9 0.75,1.43; 10 0.25,1.43; 11 -0.25,1.43; 12 -0.75,1.43 | smd 0.8 x 0.3: 5 1.43,-0.75; 6 1.43,-0.25; 7 1.43,0.25; 8 1.43,0.75; 13 -1.43,0.75; 14 -1.43,0.25; 15 -1.43,-0.25; 16 -1.43,-0.75 | smd 1.63 x 1.63: GND 0,0
FHXXX = smd 1 x 0.95: 1 -0.925,-0.775; 2 0.925,-0.775; 3 0.925,0.775; 4 -0.925,0.775

### Placement (x,y rotation side)
C1  35.89,36.47 180 top
C2  32.59,33.93 90 top
C3  49.61,2.43 180 top
C4  33.35,11.57 180 top
C5  23.45,11.83 0 top
C6  30.3,10.05 0 top
C7  29.03,48.79 180 top
C8  26.24,47.64 90 top
C9  44.53,2.43 180 top
C10  54.18,8.02 180 top
C11  43.51,34.94 180 top
C12  39.7,36.72 0 top
C13  47.58,29.61 180 top
C14  41.73,22.5 0 top
C15  33.86,30.12 90 top
C16  13.79,53.48 270 top
C17  20.91,16.65 0 top
C18  19.13,12.84 0 top
C19  23.19,18.43 90 top
C20  20.91,51.71 180 top
C21  19,29.86 270 top
C22  32.34,30.12 90 top
C23  26.49,43.83 90 top
C24  30.69,43.07 0 top
C25  27.76,23 270 top
FB1  41.73,21.48 180 top
J3  62.05,34.43 180 top
J6  34.04,60.95 0 top
J7  34.04,5.07 0 top
JP1  3.2,33.09 270 top
L1  33.86,44.34 270 top
L2  29.54,29.61 270 top
LED1  54.36,11.12 90 top
R1  28.53,34.43 0 top
R2  56.67,11.65 270 top
R3  24.72,18.94 180 top
R4  21.41,12.84 180 top
R5  28.53,32.4 180 top
R6  13.79,12.84 90 top
R7  22.68,23 270 top
R8  25.22,20.46 90 top
R9  16.08,29.86 90 top
R10  32.84,47.26 0 top
R11  59.77,26.81 270 top
R12  58.24,26.81 270 top
R13  20.65,54.75 0 top
R14  54.18,9.54 0 top
R15  31.57,48.66 270 top
R16  22.68,20.46 90 top
R17  32.84,48.66 90 top
R18  25.22,12.34 90 top
R19  30.3,11.57 180 top
S1  20.65,53.23 270 top
S2  17.73,29.61 0 top
U1  41.73,29.35 0 top
U3  46.56,8.78 180 top
U4  13.79,16.65 0 top
U5  25.22,12.84 0 top
U7  29.54,46.12 90 top
U$2  [UMICH_SOLID_75MIL]  17.1,2.56 0 top
U$3  [UCB_CAL_75MIL]  20.4,2.56 0 top
X1  35.38,34.18 0 top

### Tracks (layer width: path | path; a pad name or v marks a point on that pad's centre or on a via)
3V3  (via drill 0.2 pad 0.25, 0.3, 0.6)
  Top 0.203: 21.34,34.01 21.17,34.18 | 24.97,32.44 24.75,32.4 R5.2 | 31.32,25.54 33.1,27.32 34.62,27.32 35.9,28.6 U1.8 | C12.2 40.14,36.8 | C12.2 40.14,40.1 v39.19,41.04 | U1.45 40.48,36.37 C12.2 | FB1.2 41.23,21.41 41.23,20.97 41.48,20.72 v42.2,20.72 | v41.48,36.72 C12.2 | v43.71,36.67 43.71,35.9 43.08,35.27 C11.2 42.98,34.85 U1.40 | U1.31 46.89,29.6 C13.2 47.07,29.28 47.07,27.64 | 47.03,27.6 U1.27 | 47.03,27.6 47.04,27.6 | 47.07,27.64 47.03,27.6 | 47.07,27.64 47.89,26.81 v48.97,26.81 48.97,23.63 v47.58,22.24 | 52.07,26.38 v51.64,26.81 | 52.07,26.38 55.45,23 56.59,23 56.67,22.92 R2.1 | 52.07,26.38 R12.2 R11.2 60.46,26.38 v60.78,26.56 | J3.1 63.83,35.58 65.99,35.58 66.88,34.69 66.88,29.35 64.09,26.56 v63.83,26.56 | J6.4 39.12,47.46 v39.19,47.39
  Top 0.254: v28.53,43.83 29.03,43.83 29.29,44.09 U7.14 | R17.2 32.92,49.17 33.86,49.17 | R10.2 33.86,47.84 33.86,49.17 | v34.37,49.17 33.86,49.17
  Top 0.508: v38.18,23 38.94,22.24 39.66,21.48 FB1.2
  Top 0.762: 18.11,34.18 21.17,34.18 24.95,34.18 24.97,33.95 | 18.11,34.18 3.38,34.18 JP1.4 | 24.97,33.95 24.97,32.44 24.97,29.35 28.78,25.54 31.32,25.54 v32.59,24.27 | 24.97,33.95 24.97,34.94 27.51,36.72 31.07,36.72 33.86,39.51 v33.86,41.01 L1.P$2 33.94,42.99 | 18.11,34.18 18.11,30.88
  Bottom 0.203: 36.15,47.38 v39.19,47.38 v39.19,47.39 | v41.48,36.72 41.54,36.67 v43.71,36.67 | v42.2,20.72 46.05,20.72 v47.58,22.24 | v51.64,26.81 v48.97,26.81 | v60.78,26.56 v63.83,26.56 | v39.19,41.04 33.86,41.04 v33.86,41.01
  Bottom 0.254: v28.53,43.83 28.53,42.56 28.78,42.31 v32.08,42.31 35.38,42.31 36.15,43.07 36.15,47.38 36.15,47.39 v34.37,49.17
  Bottom 0.508: v32.59,24.27 33.86,23 v38.18,23
  pour Top (no thermals): 30.94,43.58 30.94,41.8 36.4,41.8 36.4,43.58
  pour Top (isolate 0.305, no thermals): 19.26,30.12 17.86,30.12 17.86,31.01 18.49,31.01 18.49,30.62 19.26,30.62
3V3_GATED  (via drill 0.3, 0.51)
  Top 0.203: R8.2 28.99,20.9 v30.56,19.33 30.72,19.16 U5.V+ | U3.1 53.42,9.54 R14.1 C10.2
  Top 0.762: 17.48,27.96 17.48,22.12 v19.13,20.46
  Bottom 0.203: 30.56,20.46 v30.56,19.33
  Bottom 0.762: v19.13,20.46 30.56,20.46 35.13,20.46 41.23,14.37 48.59,14.37 U3.1
  pour Top (isolate 0.305, no thermals): 17.22,27.83 17.22,28.97 17.35,29.1 17.6,29.1 17.6,28.21 17.73,28.08 17.73,27.83
5V  (via drill 0.3)
  Top 0.203: C20.1 21.34,52.94 S1.3 22.3,52.98
  Top 0.254: 20.65,48.72 20.71,48.66 | 25.22,46.12 25.22,46.88 25.48,47.13 26.32,47.13 | 26.32,47.13 C8.1 | 26.32,47.13 26.75,47.13 27.51,46.37 U7.10 | 27,44.59 28.7,44.59 U7.13
  Top 0.762: JP1.1 9.88,48.66 20.71,48.66 24.21,48.66 24.16,49.62 | 24.16,49.62 24.16,45.66 24.21,45.61 25.22,45.61 | 24.16,49.62 24.16,51.2 | v40.97,51.2 40.97,52.21 41.73,52.98 41.73,59.61 J6.2 | v26.49,51.2 24.16,51.2 | 24.16,51.2 24.16,52.52 23.7,52.98 22.3,52.98
  Bottom 0.762: v40.97,51.2 v26.49,51.2
  pour Top (no thermals): 28.53,45.99 28.53,45.23 28.15,45.23 27.26,44.34 24.72,44.34 24.72,47.39 24.97,47.39 25.99,46.37 26.88,46.37 27.26,45.99
  pour Top (isolate 0.305, no thermals): 21.16,53.1 22.18,53.1 22.3,53.23 22.68,53.23 22.68,52.72 22.05,52.72 21.92,52.85 21.16,52.85
5V_GATED
  Top 0.203: 14.18,50.85 13.79,51.24 C16.2
  Top 0.762: U4.5V_1 14.18,50.85 U4.5V_2 16.5,50.85 19.13,53.48
  pour Top (isolate 0.305, no thermals): 20.14,53.36 19.38,53.36 19.26,53.23 18.87,53.23 18.87,53.61 19,53.74 20.14,53.74
!RESET  (via drill 0.3)
  Top 0.203: v19.38,18.18 20.14,18.94 20.14,25.04 23.7,28.59 v23.7,30.62 | v27.26,8.27 33.61,8.27 J7.20 | v35.64,31.13 36.4,31.13 36.91,30.62 38.21,30.62 U1.4 | v46.81,34.18 46.81,40.02 47.58,40.78 62.05,40.78 63.07,39.77 63.07,36.21 62.05,35.2
  Top 0.254: J3.3 62.05,35.2
  Bottom 0.203: v27.26,8.27 19.38,16.15 v19.38,18.18 | v23.7,30.62 24.21,31.13 v35.64,31.13 38.69,34.18 v46.81,34.18
AMP_OUT  (via drill 0.3)
  Top 0.203: C6.2 R19.1 31.26,11.57 | 31.26,11.57 C4.2 | U5.OUT_B v32.59,16.65 32.84,16.4 32.84,13.16 31.26,11.57 | v35.38,25.8 36.65,25.8 | v36.4,16.65 36.65,16.91 36.65,25.8 | 37.92,27.07 36.65,25.8 | 38.2,27.07 U1.11
  Top 0.254: 38.2,27.07 37.92,27.07
  Bottom 0.203: v35.38,25.8 8.71,25.8 8.13,26.31 5.21,29.23 3.25,29.23 JP1.6 | v36.4,16.65 v32.59,16.65
DBG_GPIO1  (via drill 0.3)
  Top 0.203: v38.18,14.62 38.18,14.88 46.05,22.75 v46.05,25.29 45.85,25.09 44.22,25.09 43.98,25.33 U1.23
  Bottom 0.203: v38.18,14.62 38.18,10.81 35.89,8.53 32.34,8.53 J7.16
DBG_GPIO2  (via drill 0.3)
  Top 0.203: v39.19,13.61 39.19,15.13 47.58,23.51 v47.58,25.29 47.01,25.85 U1.24
  Bottom 0.203: v39.19,13.61 39.19,10.81 36.65,8.27 36.65,5.22 J7.19
DBG_RX  (via drill 0.3)
  Top 0.203: v18.11,18.18 13.29,23 v13.29,27.07 | 13.29,35.7 v13.29,35.73 v13.29,37.99 | U1.38 43.98,33.38 44.27,33.67 45.04,33.67 46,34.64 v46,38.12
  Bottom 0.203: v13.29,35.73 v13.29,27.07 | 13.29,39.44 v13.29,37.99 | 13.29,39.44 44.68,39.44 v46,38.12 | v18.11,18.18 18.11,13.86 26.75,5.22 31.65,5.22 J7.18 | JP1.2 13.29,39.44
DBG_TX  (via drill 0.3)
  Top 0.203: v11.76,27.07 v11.76,17.92 | U1.39 43.48,33.39 44.27,34.18 44.78,34.18 45.16,34.56 v45.16,36.67
  Bottom 0.203: 11.76,36.85 9.3,36.85 3.51,36.9 JP1.3 | v11.76,17.92 11.76,15.13 25.22,1.67 30.63,1.67 J7.17 | 11.76,36.85 v11.76,27.07 | v45.16,36.67 45.16,37.36 43.97,38.55 15.62,38.55 13.92,36.85 11.76,36.85
GND  (via drill 0.2, 0.2 pad 0.25, 0.3, 0.41, 0.6, 2.95 pad 6.35)
  Top 0.203: v30.05,46.63 29.79,46.88 U7.6 | U1.6 38.94,29.6 39.19,29.35 | v39.7,31.39 38.98,32.1 U1.48 | 44.27,28.85 44.53,29.1 U1.30 | 58.09,34.49 60.2,34.49 J3.5 | S1.2 20.4,52.98 S1.PAD | S2.2 17.98,29.36 S2.PAD
  Top 0.254: U7.8 28.78,47.56 28.78,48.15 29.29,48.15 | 29.29,48.15 U7.7 | 29.29,48.15 29.3,48.15 29.54,48.15 | 29.54,48.15 29.47,48.23 C7.1 | 29.54,48.15 29.8,48.15 | U7.6 29.8,48.15 | 29.8,48.15 30.3,48.66 30.3,49.17 | v39.7,28.85 v39.7,27.58 | v40.97,28.85 41.23,28.85 U1.THERMAL | U1.17 v40.98,27.56 v40.97,27.58 | 44.27,28.85 v43.77,28.85 | U1.30
  other vias: 29.03,45.61 29.03,46.63 29.54,46.12 30.05,45.61 30.94,44.21 34.88,29.61 38.94,37.74 39.7,30.12 40.46,24.78 40.97,30.12 40.97,31.39 41.23,23.51 42.5,27.58 42.5,28.85 42.5,30.12 42.5,31.39 43.77,27.58 43.77,30.12 43.77,31.39 48.34,17.19 48.85,28.85 58.47,42.26 36.15,37.74 44.53,35.7 58.22,38.45 13.08,62.22 54.99,62.22 54.99,3.8 13.08,3.8
  pour Top (no thermals): 24.72,43.32 29.16,43.32 29.67,43.83 29.67,45.23 29.54,45.36 30.3,45.36 30.43,45.23 30.43,44.85 30.69,44.59 31.07,44.59 31.32,44.34 31.32,44.09 31.07,43.83 30.81,43.83 30.56,43.58 30.56,41.8 24.72,41.8
  pour Bottom (isolate 0.203, rank 2): -7.8,73.8 -7.8,-10.02 78.56,-10.02 78.56,75.07 -7.8,75.07
  pour Top (isolate 0.203, rank 2): -3.99,71.26 -3.99,-7.48 74.75,-7.48 74.75,72.53 -3.99,72.53
I2C_CLK
  Top 0.203: U1.44 40.98,34.45 42.24,35.96 42.25,50.19 44.27,52.21 44.27,59.83 43,61.1 37.7,61.1 J6.5
I2C_DATA
  Top 0.203: U1.43 41.48,34.18 42.75,35.7 42.75,49.93 45.54,52.72 45.54,63.14 44.27,64.41 36.15,64.41 35.38,63.64 35.38,60.88 J6.6
IF
  Top 0.203: 10.24,16.65 3.2,23.69 JP1.8
  Top 0.254: 10.24,16.65 U4.IF_1 | U4.IF_1 R6.2 | U4.IF_1 U4.IF_2 C17.1
MOD_IN  (via drill 0.3)
  Top 0.203: U1.21 42.98,24.29 43.51,23.77 v43.77,23.77
  Bottom 0.203: v43.77,23.77 55.7,23.77 56.21,24.27 56.21,53.48 54.94,54.75 32.84,54.75 31.57,56.02 31.5,56.1 J6.10
MOD_OUT  (via drill 0.3, 0.6)
  Top 0.203: v35.54,53.08 34.11,54.5 34.11,54.75 34.04,54.83 J6.8 | U1.22 43.48,24.81 43.77,24.53 v44.27,24.53
  Bottom 0.203: v44.27,24.53 54.69,24.53 55.45,25.29 55.45,52.04 54.41,53.08 v35.54,53.08
MSGEQ_OUT  (via drill 0.3)
  Top 0.203: 38.13,26.5 37.16,25.53 37.16,13.61 38.18,12.59 40.21,12.59 41.73,11.07 44.78,11.07 45.29,11.57 U3.3 | 38.18,26.46 38.18,24.78 v39.19,23.77
  Top 0.254: U1.12 38.13,26.5 38.18,26.46
  Bottom 0.203: v39.19,23.77 39.19,21.99 38.94,21.73 30.3,21.73 27.76,24.27 6.43,24.27 3.96,26.74 JP1.7
MSGEQ_RESET
  Top 0.203: U1.34 45.26,31.13 49.86,31.13 50.24,30.75 50.24,22.62 49.1,21.48 49.1,11.32 47.83,10.05 U3.7
MSGEQ_STROBE
  Top 0.203: U3.4 43,12.84 43,16.65 49.71,23.36 49.71,30.01 49.1,30.62 45.25,30.62 U1.33
N$1
  Top 0.203: R16.2 R7.2 25.78,22.57 C25.2 25.99,23 24.21,21.23 24.21,20.21 24.46,19.96 25.15,19.96 R8.1 26.93,20.03 28.53,18.43 28.53,16.4 29.03,15.89 31.57,15.89 31.83,15.64 31.83,14.37 31.57,14.11 U5.+IN_B
N$2  (via drill 0.3)
  Top 0.203: C3.1 50.26,4.86 U3.8 | R14.2 v56.34,9.54
  Bottom 0.203: U3.8 50.37,6.37 53.55,9.54 v56.34,9.54
N$3  (via drill 0.3)
  Top 0.203: v33.61,12.84 34.11,12.34 34.11,11.69 C4.1 | v37.16,11.57 39.7,11.57 42.75,8.53 U3.5
  Bottom 0.203: v33.61,12.84 34.88,11.57 v37.16,11.57
N$6
  Top 0.203: L2.P$2 30.88,27.83 34.37,27.83 35.64,29.1 U1.7
N$7
  Top 0.203: C9.1 45.18,4.86 U3.6
N$9
  Top 0.203: R16.1 22.61,19.96 21.92,19.96 21.67,19.7 21.67,17.16 21.16,16.65 C17.2 21.16,16.58 21.16,15.89 21.67,15.38 U5.+IN_A
N$10
  Top 0.203: U1.29 46.04,28.6 46.31,28.34 46.05,28.08 45.25,28.08
  Top 0.254: 45.25,28.08 U1.28
N$11
  Top 0.203: U1.26 46.02,27.1 46.31,26.81 46.05,26.56 45.28,26.56
  Top 0.254: 45.28,26.56 U1.25
N$12
  Top 0.203: 25.3,12.84 R4.1 21.85,12.41 22.43,11.83 C5.1 | 25.3,12.84 R18.2 | 25.3,12.84 25.99,12.84 26.49,13.35 26.49,16.15 25.99,16.65 U5.-IN_A
N$13
  Top 0.203: U1.19 41.98,23.48 42.17,23.15 C14.2 FB1.1
N$14
  Top 0.203: U1.3 38.21,31.13 37.16,31.13 36.4,31.89 34.88,31.89 34.37,32.4 R5.1 R1.2
N$15
  Top 0.203: R4.2 C18.2
N$17
  Top 0.203: C19.1 23.27,17.92 U5.OUT_A 26.49,17.92 27,17.42 27,12.59 26.49,12.08 25.4,12.08 R18.1 23.95,11.9 C5.2 23.95,11.75
N$18
  Top 0.203: C19.2 24.21,18.87 R3.2
N$19
  Top 0.203: R3.1 27,18.94 27.76,18.18 27.76,15.64 28.02,15.38 30.3,15.38 | 30.3,15.38 29.8,14.88 29.8,11.57 R19.2 C6.1 | U5.-IN_B 30.3,15.38
N$34
  Top 0.203: LED1.A 56.38,11.08 R2.2
N$35
  Top 0.203: U1.36 49.73,32.1 50.7,31.13 50.7,14.02 LED1.C 53.37,11.36
N$36
  Top 0.203: L2.P$1 32.89,30.81 C22.2 33.57,30.77 C15.2 34.04,30.37 36.15,30.37 36.4,30.12 38.22,30.12 U1.5
N$42
  Top 0.254: U7.9 28.11,48.3 C7.2
N$43
  pour Top (no thermals): 30.69,46.37 31.57,46.37 31.83,46.63 34.5,46.63 34.75,46.37 34.75,44.98 34.62,44.85 31.7,44.85 31.19,45.36 30.69,45.36
N$44
  Top 0.254: U7.4 31.37,47.26 R10.1
N$45
  Top 0.254: U7.5 30.29,47.88 30.56,48.15 31.5,48.15 R15.2 31.65,48.15 32.77,48.15 R17.1
N$46
  cutout Top: 31.83,44.59 31.83,43.83 35.89,43.83 35.89,46.88 35.38,47.39 33.86,47.39 33.86,46.88 34.88,46.88 35.13,46.63 35.13,44.59
N$47
  cutout Top: 24.72,44.09 24.72,43.58 28.02,43.58 28.02,44.09
PPS  (via drill 0.3)
  Top 0.203: U1.20 42.48,23.78 v43.26,23
  Bottom 0.203: v43.26,23 56.21,23 56.97,23.77 56.97,53.74 54.69,56.02 36.25,56.02 35.46,56.81 35.46,61.03 34.27,62.22 J6.7
RADAR_POWER_GATE  (via drill 0.3)
  Top 0.203: v22.18,40.53 v22.18,35.7 | v39.45,24.78 39.98,25.32 U1.15 | v22.18,54.37 21.41,54.37 | 21.41,54.37 21.41,53.52 S1.4 | R13.2 21.41,54.43 21.41,54.37 | v16.08,31.13 R9.2 16.12,30.33 S2.4
  Bottom 0.203: v22.18,54.37 v22.18,40.53 | v22.18,35.7 22.18,31.13 | 22.18,31.13 22.18,29.35 v22.68,28.85 24.97,28.85 27.26,26.56 35.64,26.56 37.42,24.78 v39.45,24.78 39.7,24.78 | 22.18,31.13 v16.08,31.13
SWDCLK  (via drill 0.3)
  Top 0.203: U1.9 38.21,28.08 36.4,28.08 v35.89,27.58 35.64,27.58 34.88,26.81 34.11,26.81 33.61,26.31 33.61,14.37 34.88,13.1 34.88,8.78 36.65,7 36.65,5.22 J7.21 | 58.18,28.08 v54.43,28.08 | 58.18,28.08 61.98,28.08 63.07,29.18 63.07,32.91 62.18,33.8 J3.4 | R12.1 58.24,28.02 58.18,28.08
  Bottom 0.203: v35.89,27.58 36.65,27.58 37.67,26.56 46.05,26.56 47.58,28.08 v54.43,28.08
SWDIO  (via drill 0.3)
  Top 0.203: U1.10 37.19,27.6 v36.4,26.81 35.38,26.81 34.37,25.8 34.37,14.62 35.64,13.35 35.64,8.55 J7.22 | v54.43,25.54 61.04,25.54 62.74,27.25 | R11.1 62.74,27.25 | 62.74,27.25 65.35,29.86 | J3.2 63.32,33.67 63.58,33.67 63.83,33.42 65.86,33.42 66.37,32.91 66.37,32.69 66.42,32.65 66.42,31.14 66.37,31.1 66.37,30.88 65.35,29.86 | 65.36,29.85 65.35,29.86
  Bottom 0.203: v36.4,26.81 37.16,26.05 48.59,26.05 49.1,25.54 v54.43,25.54
USB+
  Top 0.203: U1.47 39.48,34.14 37.42,36.21 37.42,47.39 27.76,57.04 27.76,61.1 28.88,62.22 J6.11
USB-
  Top 0.203: U1.46 39.98,34.41 37.92,36.47 37.92,47.64 29.03,56.53 29.03,56.79 arc-90 29.26,57.02 29.5,57.02 arc90 29.73,57.24 29.73,57.37 arc90 29.5,57.6 28.57,57.6 arc-90 28.34,57.83 28.34,57.95 arc-90 28.57,58.18 29.5,58.18 arc90 29.73,58.41 29.73,58.53 arc90 29.5,58.76 29.26,58.76 arc-90 29.03,58.99 29.03,59.61 J6.12
XIN
  Top 0.203: X1.3 36.31,36.45 C1.1 | 36.4,35.05 X1.3 | X1.3 37.66,34.96 37.92,34.69 37.92,32.41 U1.1
XOUT
  Top 0.203: C2.1 34.37,33.49 34.66,33.21 | 34.45,33.42 X1.1 | X1.1 34.46,33.07 | 34.66,33.21 X1.1 | 34.66,33.21 35.46,32.4 36.65,32.4 37.45,31.6 38.16,31.6 38.2,31.64 U1.2

### Text on the board
tPlace: USB | PPS | SCL | GND | + | GND | - | USB | IN | OUT | SDA | VCCIO | 5V | 5V | TX | RX | 3V3 | GND | AMP_OUT | MSGEQ_OUT | IF | Yifan Hao / Joshua Adkins / July 2017 | B | Signpost Microwave Radar Module
Measures: 0.358 / 9.10 Below PCB | 0.1 / 2.54 Above PCB
Reference: Drill 0.116 @ (-0.825, 1.15) | Drill 0.116 @ (0.825, 1.15) | GND | GND | Drill 0.116 @ (-0.825, -1.15) | Drill 0.116 @ (0.825, -1.15) | GND | GND